# EAGLE design FPCadapter (EAGLE 9.3.1)
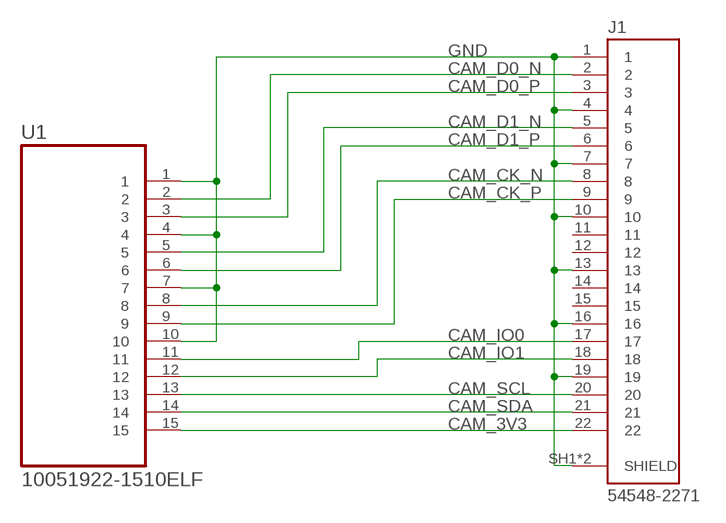
[diagram p0: schematic, sheet 1]

## Parts
J1  54548-2271  [MOLEX_54548-2271]
U1  10051922-1510ELF  [FCI_10051922-1510ELF]

## Nets
CAM_3V3 [pwr]: J1.22 U1.15
CAM_CK_N [diff_pairs]: J1.8 U1.8
CAM_CK_P [diff_pairs]: J1.9 U1.9
CAM_D0_N [diff_pairs]: J1.2 U1.2
CAM_D0_P [diff_pairs]: J1.3 U1.3
CAM_D1_N [diff_pairs]: J1.5 U1.5
CAM_D1_P [diff_pairs]: J1.6 U1.6
CAM_IO0: J1.17 U1.11
CAM_IO1: J1.18 U1.12
CAM_SCL: J1.20 U1.13
CAM_SDA: J1.21 U1.14
GND [pwr]: J1.1 J1.4 J1.7 J1.10 J1.13 J1.16 J1.19 J1.SH1(SHIELD) J1.SH2(SHIELD) U1.1 U1.4 U1.7 U1.10
Unconnected: J1.11 J1.12 J1.14 J1.15

## Library data of the parts
J1 = RPI_CAM:54548-2271: Conn FFC/FPC Connector SKT 22 POS 0.5mm Solder RA SMD Easy-On™ T/R; AVAILABILITY: Unavailable; DESCRIPTION: Conn FFC/FPC Connector SKT 22 POS 0.5mm Solder RA SMD Easy-On™ T/R; MF: Molex; MP: 54548-2271; PACKAGE: None; PRICE: None
U1 = RPI_CAM:10051922-1510ELF: FFC/FPC CONNECTOR, 15POS, 1ROW; AVAILABILITY: Good; DESCRIPTION: Conn; Rect; FPC/FFC; ZIF; 15Cnts; SMT; VLL Series; 0.5mmPinSpng; RtAng; LowerSideContact; MF: FCI; MPN: 10051922-1510ELF; PACKAGE: None; PRICE: 0.44 USD

## Net classes
1 diff_pairs: width 0.203 mm, clearance 0.152 mm
2 pwr: width 0.254 mm

## Board
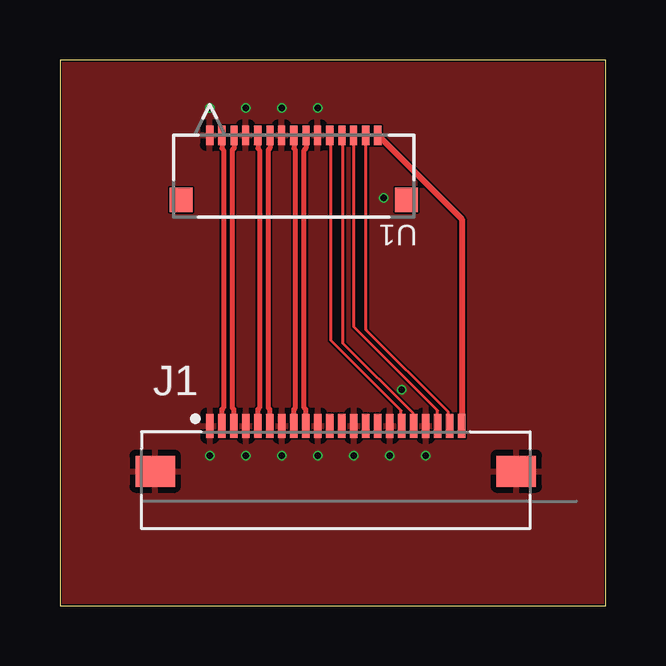
[diagram p1: board, top side]
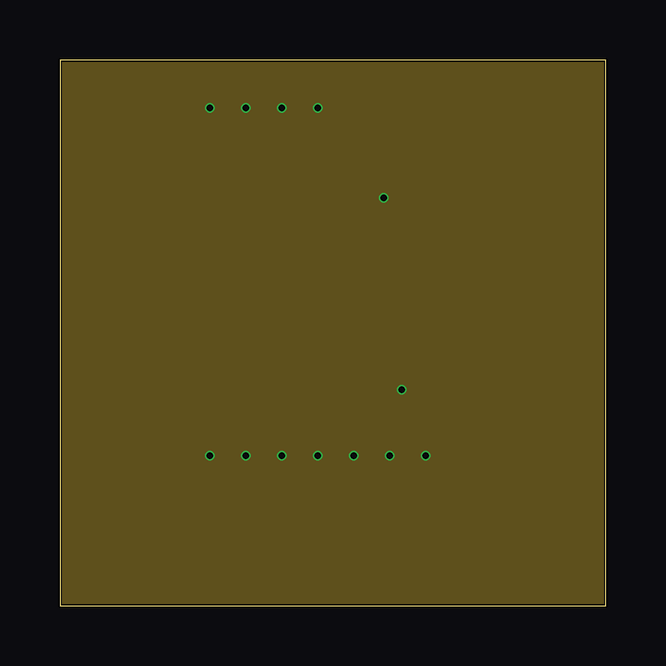
[diagram p2: board, inner layer Route2]
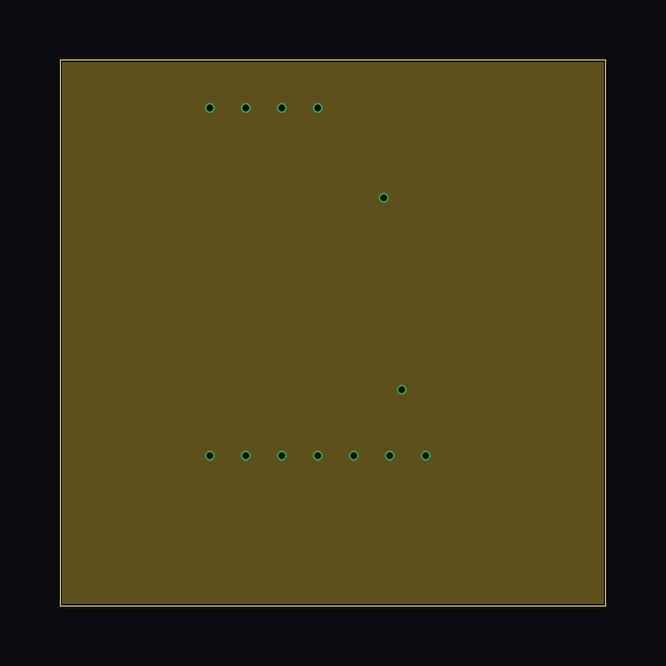
[diagram p3: board, inner layer Route15]
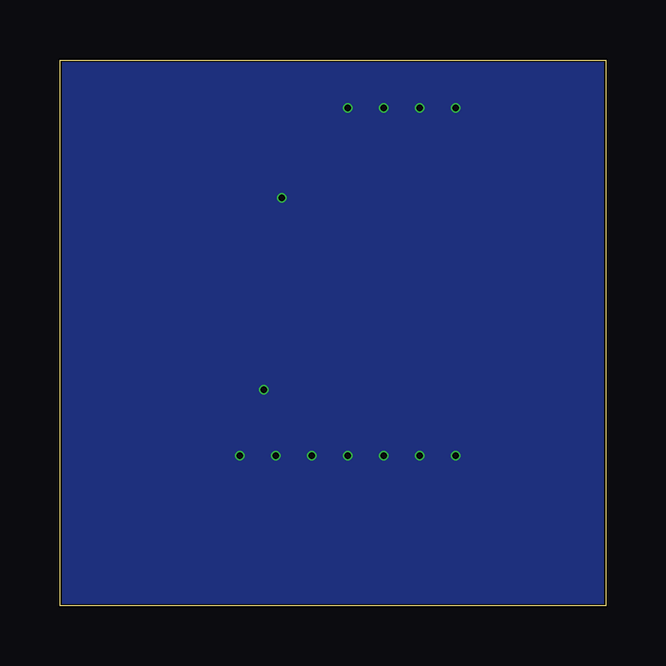
[diagram p4: board, bottom side, seen from below]

Size 22.75 x 22.75 mm. Coordinates in mm from the lower left corner, seen from the top.
Outline: 0,0 22.75,0 22.75,22.75 0,22.75 0,0
Copper layers (1*2*15*16): Top 0.035mm / dielectric 0.23mm / Route2 0.035mm / dielectric 0.93mm / Route15 0.035mm / dielectric 0.23mm / Bottom 0.035mm
Design rules "MF_Extended_4_Layer": minimum track width 3mil, minimum drill 10mil, track to track 3mil, track to pad 3mil, pad to pad 3mil, via to via 3mil, smd to smd 0mil, copper to edge 3mil, drill to drill 3mil, minimum pad ring 3mil, minimum via ring 3mil, stop-mask expansion 2mil, vias tented up to drill 25mil, thermal gap 10mil

### Footprints (pad centres in the part's own frame; a part is rotated, then mirrored left to right if it is on the bottom)
MOLEX_54548-2271 = smd 0.3 x 1: 1 -5.25,0; 2 -4.75,0; 3 -4.25,0; 4 -3.75,0; 5 -3.25,0; 6 -2.75,0; 7 -2.25,0; 8 -1.75,0; 9 -1.25,0; 10 -0.75,0; 11 -0.25,0; 12 0.25,0; 13 0.75,0; 14 1.25,0; 15 1.75,0; 16 2.25,0; 17 2.75,0; 18 3.25,0; 19 3.75,0; 20 4.25,0; 21 4.75,0; 22 5.25,0 | smd 1.65 x 1.3: SH1 -7.525,-1.9; SH2 7.525,-1.9
FCI_10051922-1510ELF = smd 0.305 x 0.813: 1 3.505,-2.108; 2 2.997,-2.108; 3 2.489,-2.108; 4 2.007,-2.108; 5 1.499,-2.108; 6 0.991,-2.108; 7 0.508,-2.108; 8 0,-2.108; 9 -0.508,-2.108; 10 -0.991,-2.108; 11 -1.499,-2.108; 12 -2.007,-2.108; 13 -2.489,-2.108; 14 -2.997,-2.108; 15 -3.505,-2.108 | smd 0.965 x 1.016: 16 -4.699,0.584; 17 4.699,0.584

### Placement (x,y rotation side)
J1  11.5,7.5 0 top
U1  9.75,17.5 180 top

### Tracks (layer width: path | path; a pad name or v marks a point on that pad's centre or on a via)
CAM_3V3
  Top 0.254: U1.15 16.75,16.11 J1.22
CAM_CK_N
  Top 0.203: J1.8 9.75,8.18 9.82,8.25 9.82,19 9.75,19.07 U1.8
CAM_CK_P
  Top 0.203: J1.9 10.25,8.18 10.18,8.25 10.18,19 10.26,19.08 U1.9
CAM_D0_N
  Top 0.203: J1.2 6.75,8.18 6.82,8.25 6.82,19 6.75,19.07 U1.2
CAM_D0_P
  Top 0.203: J1.3 7.25,8.18 7.18,8.25 7.18,19 7.26,19.08 U1.3
CAM_D1_N
  Top 0.203: U1.5 8.25,19.07 8.32,19 8.32,8.25 8.25,8.18 J1.5
CAM_D1_P
  Top 0.203: U1.6 8.76,19.08 8.68,19 8.68,8.25 8.75,8.18 J1.6
CAM_IO0
  Top 0.127: U1.11 11.3,19.56 11.3,11.05 14.22,8.13 14.22,7.56 J1.17
CAM_IO1
  Top 0.127: U1.12 11.81,19.56 11.81,10.92 14.73,8 14.73,7.56 J1.18
CAM_SCL
  Top 0.127: U1.13 12.26,19.56 12.26,11.62 15.75,8.13 15.75,7.56 J1.20
CAM_SDA
  Top 0.127: U1.14 12.76,19.56 12.76,11.49 16.19,8.06 16.19,7.56 J1.21
GND  (via drill 0.25)
  Top 0.254: 4,5.65 J1.SH1 | 18.99,5.65 J1.SH2
  other vias: 13.5,17 14.25,9 9.25,20.75 10.75,20.75 7.75,20.75 6.25,20.75 7.75,6.25 6.25,6.25 9.25,6.25 10.75,6.25 12.25,6.25 13.75,6.25 15.25,6.25
  pour Route2: -0.5,24.25 24.5,24.25 24.75,24 24.75,-0.75 -1.5,-0.75 -1.5,24.25 -0.75,24.25
  pour Route15: 0,23.75 25,23.75 25.25,23.5 25.25,-1.25 -1,-1.25 -1,23.75 -0.25,23.75
  pour Bottom: -1,24.75 24,24.75 24.25,24.5 24.25,-0.25 -2,-0.25 -2,24.75 -1.25,24.75
  pour Top: 0.5,25 25.5,25 25.75,24.75 25.75,0 -0.5,0 -0.5,25 0.25,25